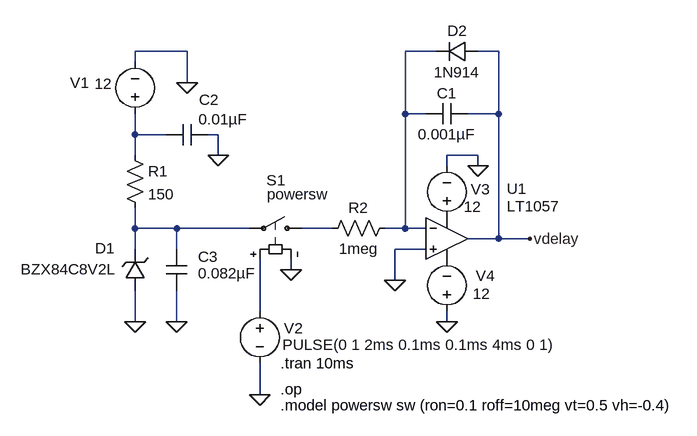
[diagram p0: schematic Laser Diode Driver EDN Version.asc]
Laser Diode Driver EDN Version.asc, the LTspice schematic file:
Version 4
SHEET 1 880 680
WIRE -32 16 -112 16
WIRE 352 16 304 16
WIRE 448 16 416 16
WIRE -112 32 -112 16
WIRE -32 64 -32 16
WIRE 304 112 304 16
WIRE 336 112 304 112
WIRE 448 112 448 16
WIRE 448 112 400 112
WIRE -112 144 -112 112
WIRE -64 144 -112 144
WIRE 16 144 0 144
WIRE -112 176 -112 144
WIRE 16 176 16 144
WIRE 416 176 368 176
WIRE 368 192 368 176
WIRE 416 192 416 176
WIRE -112 288 -112 256
WIRE -48 288 -112 288
WIRE 64 288 -48 288
WIRE 192 288 144 288
WIRE 304 288 304 112
WIRE 304 288 272 288
WIRE 336 288 304 288
WIRE 448 304 448 112
WIRE 448 304 400 304
WIRE 496 304 448 304
WIRE -112 320 -112 288
WIRE -48 320 -48 288
WIRE 336 320 288 320
WIRE 128 352 128 336
WIRE 288 368 288 320
WIRE 80 416 80 336
WIRE -112 432 -112 384
WIRE -48 432 -48 384
WIRE 368 432 368 416
WIRE 80 544 80 496
FLAG -32 64 0
FLAG -112 432 0
FLAG 128 352 0
FLAG 416 192 0
FLAG 368 432 0
FLAG 288 368 0
FLAG 80 544 0
FLAG 496 304 vdelay
FLAG 16 176 0
FLAG -48 432 0
SYMBOL res -128 160 R0
SYMATTR InstName R1
SYMATTR Value 150
SYMBOL zener -96 384 R180
WINDOW 0 47 65 Left 0
WINDOW 3 45 33 Left 0
SYMATTR InstName D1
SYMATTR Value BZX84C8V2L
SYMBOL voltage -112 128 R180
WINDOW 0 71 64 Left 0
WINDOW 3 35 62 Left 0
WINDOW 123 0 0 Left 0
WINDOW 39 0 0 Left 0
SYMATTR InstName V1
SYMATTR Value 12
SYMBOL Opamps\\LT1057 368 240 R0
WINDOW 0 92 -13 Left 0
WINDOW 3 92 14 Left 0
SYMATTR InstName U1
SYMBOL sw 160 288 M270
WINDOW 0 74 70 VLeft 0
WINDOW 3 52 69 VLeft 0
SYMATTR InstName S1
SYMATTR Value powersw
SYMBOL voltage 80 400 R0
WINDOW 0 37 42 Left 0
WINDOW 3 35 67 Left 0
WINDOW 123 0 0 Left 0
WINDOW 39 0 0 Left 0
SYMATTR InstName V2
SYMATTR Value PULSE(0 1 2ms 0.1ms 0.1ms 4ms 0 1)
SYMBOL res 288 272 R90
WINDOW 0 0 56 VBottom 0
WINDOW 3 32 56 VTop 0
SYMATTR InstName R2
SYMATTR Value 1meg
SYMBOL cap 400 96 R90
WINDOW 0 0 32 VBottom 0
WINDOW 3 32 32 VTop 0
SYMATTR InstName C1
SYMATTR Value 0.001µF
SYMBOL diode 416 0 R90
WINDOW 0 0 32 VBottom 0
WINDOW 3 32 32 VTop 0
SYMATTR InstName D2
SYMATTR Value 1N914
SYMBOL voltage 368 288 R180
WINDOW 0 -66 60 Left 0
WINDOW 3 -53 33 Left 0
WINDOW 123 0 0 Left 0
WINDOW 39 0 0 Left 0
SYMATTR InstName V3
SYMATTR Value 12
SYMBOL voltage 368 432 R180
WINDOW 0 -74 71 Left 0
WINDOW 3 -67 43 Left 0
WINDOW 123 0 0 Left 0
WINDOW 39 0 0 Left 0
SYMATTR InstName V4
SYMATTR Value 12
SYMBOL cap 0 128 R90
WINDOW 0 -22 -2 VBottom 0
WINDOW 3 -23 -24 VTop 0
SYMATTR InstName C2
SYMATTR Value 0.01µF
SYMBOL cap -64 320 R0
WINDOW 0 49 12 Left 0
WINDOW 3 49 37 Left 0
SYMATTR InstName C3
SYMATTR Value 0.082µF
TEXT 112 536 Left 0 !.op
TEXT 112 496 Left 0 !.tran 10ms
TEXT 112 560 Left 0 !.model powersw sw (ron=0.1 roff=10meg vt=0.5 vh=-0.4)

The netlist it stands for:
* Laser Diode Driver EDN Version.asc
R1 N002 N003 150
D1 0 N003 BZX84C8V2L
V1 N002 0 12
XU1 0 N001 P001 P002 vdelay LT1057  ; pins In+ In- V+ V- OUT
S1 N004 N003 N005 0 powersw
V2 N005 0 PULSE(0 1 2ms 0.1ms 0.1ms 4ms 0 1)
R2 N001 N004 1meg
C1 vdelay N001 0.001µF
D2 vdelay N001 1N914
V3 P001 0 12
V4 0 P002 12
C2 0 N002 0.01µF
C3 N003 0 0.082µF
.model D D
.lib standard.dio
.op
.tran 10ms
.model powersw sw (ron=0.1 roff=10meg vt=0.5 vh=-0.4)
.lib LTC.lib
.backanno
.end